# Altium schematic sheet led_driver.SchDoc
size A3; Organization: Develer s.r.l.; Address1: via Mugellese 1/A; Address2: 50019 Campi Bisenzio; Address3: Firenze; Address4: ITALY; Revision: A; SheetNumber: 1; SheetTotal: 1
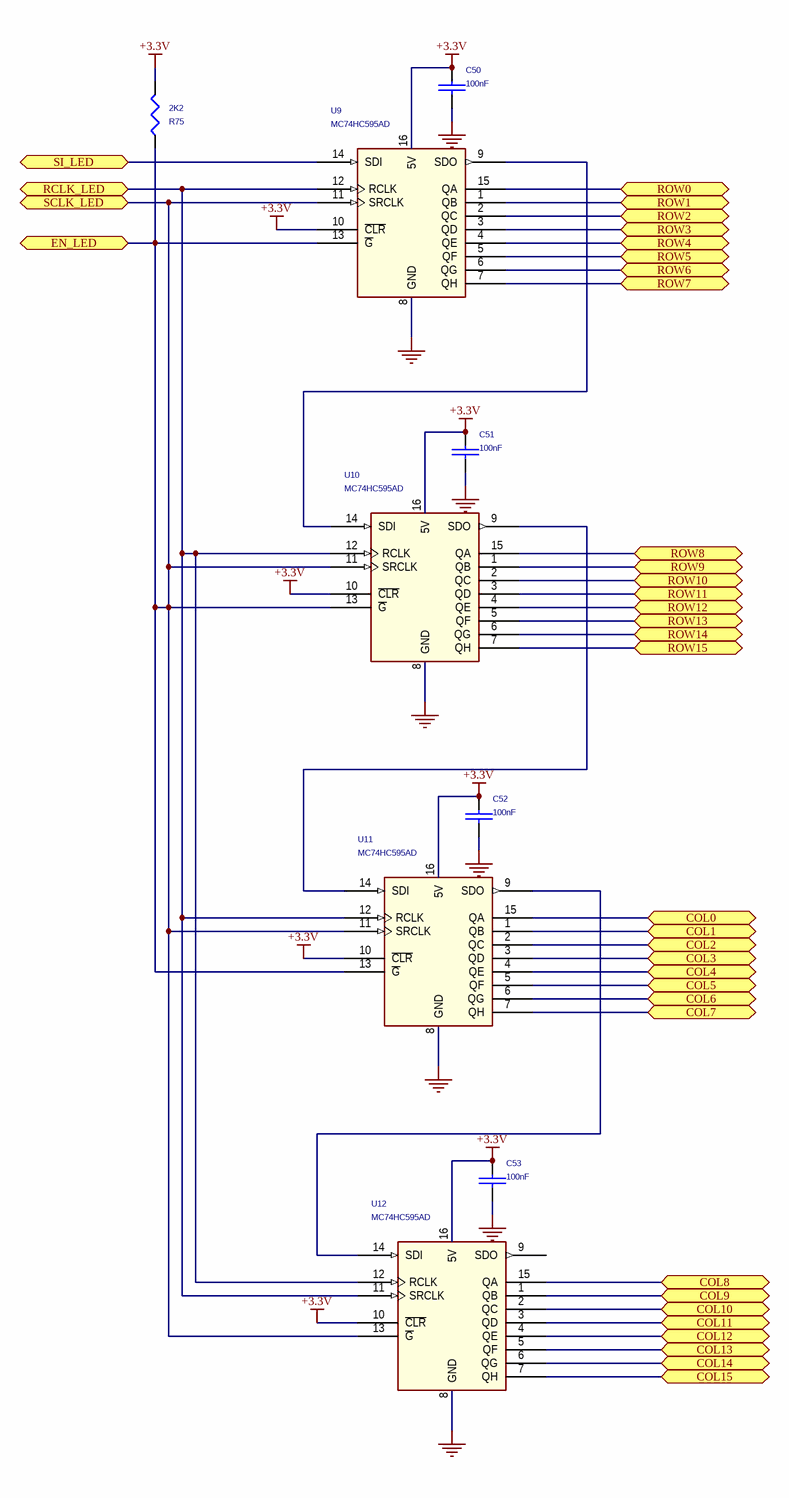
[diagram p0: led_driver.SchDoc]

## Parts
C50  100nF  [0603_[1608]]
C51  100nF  [0603_[1608]]
C52  100nF  [0603_[1608]]
C53  100nF  [0603_[1608]]
R75  2K2  [0603_[1608]]
U9  MC74HC595AD  [SOIC16]
U10  MC74HC595AD  [SOIC16]
U11  MC74HC595AD  [SOIC16]
U12  MC74HC595AD  [SOIC16]

## Ports
COL0, COL1, COL2, COL3, COL4, COL5, COL6, COL7, COL8, COL9, COL10, COL11, COL12, COL13, COL14, COL15, EN_LED, RCLK_LED, ROW0, ROW1, ROW2, ROW3, ROW4, ROW5, ROW6, ROW7, ROW8, ROW9, ROW10, ROW11, ROW12, ROW13, ROW14, ROW15, SCLK_LED, SI_LED

## Nets
+3.3V: C50.1 C51.1 C52.1 C53.1 R75.1 U9.10(~{CLR}) U9.16(5V) U10.10(~{CLR}) U10.16(5V) U11.10(~{CLR}) U11.16(5V) U12.10(~{CLR}) U12.16(5V)  [also labelled 5V]
GND: C50.2 C51.2 C52.2 C53.2 U9.8(GND) U10.8(GND) U11.8(GND) U12.8(GND)
COL0: U11.15(QA) ; port COL0
COL1: U11.1(QB) ; port COL1
COL2: U11.2(QC) ; port COL2
COL3: U11.3(QD) ; port COL3
COL4: U11.4(QE) ; port COL4
COL5: U11.5(QF) ; port COL5
COL6: U11.6(QG) ; port COL6
COL7: U11.7(QH) ; port COL7
COL8: U12.15(QA) ; port COL8
COL9: U12.1(QB) ; port COL9
COL10: U12.2(QC) ; port COL10
COL11: U12.3(QD) ; port COL11
COL12: U12.4(QE) ; port COL12
COL13: U12.5(QF) ; port COL13
COL14: U12.6(QG) ; port COL14
COL15: U12.7(QH) ; port COL15
EN_LED: R75.2 U9.11(SRCLK) U9.13(~{G}) U10.11(SRCLK) U10.13(~{G}) U11.11(SRCLK) U11.13(~{G}) U12.13(~{G}) ; port SCLK_LED, port EN_LED
RCLK_LED: U9.12(RCLK) U10.12(RCLK) U11.12(RCLK) U12.11(SRCLK) U12.12(RCLK) ; port RCLK_LED
ROW0: U9.15(QA) ; port ROW0
ROW1: U9.1(QB) ; port ROW1
ROW2: U9.2(QC) ; port ROW2
ROW3: U9.3(QD) ; port ROW3
ROW4: U9.4(QE) ; port ROW4
ROW5: U9.5(QF) ; port ROW5
ROW6: U9.6(QG) ; port ROW6
ROW7: U9.7(QH) ; port ROW7
ROW8: U10.15(QA) ; port ROW8
ROW9: U10.1(QB) ; port ROW9
ROW10: U10.2(QC) ; port ROW10
ROW11: U10.3(QD) ; port ROW11
ROW12: U10.4(QE) ; port ROW12
ROW13: U10.5(QF) ; port ROW13
ROW14: U10.6(QG) ; port ROW14
ROW15: U10.7(QH) ; port ROW15
SI_LED: U9.14(SDI) ; port SI_LED
NetU9_9: U9.9(SDO) U10.14(SDI)
NetU10_9: U10.9(SDO) U11.14(SDI)
NetU11_9: U11.9(SDO) U12.14(SDI)

Not connected (* = marked no-connect by the designer): U12 9(SDO)

## Notes on the sheet
- Title:
- File:
- asterix24@gmail.com
- Ing. Daniele Basile
- Rev:
- Date:
- Time:
- Sheet
- of

## Library data of the parts
C50-C53 = C: CER 50V X7R
R75 = R_0: Resistor; 1st: 5%
U9-U12 = 74HC595_27: 8-Bit Serial-Input/Serial or Prallel-Output Shift Register with Latched 3-State Outputs